# EAGLE schematic KombyPiMini (EAGLE 7.2.0)
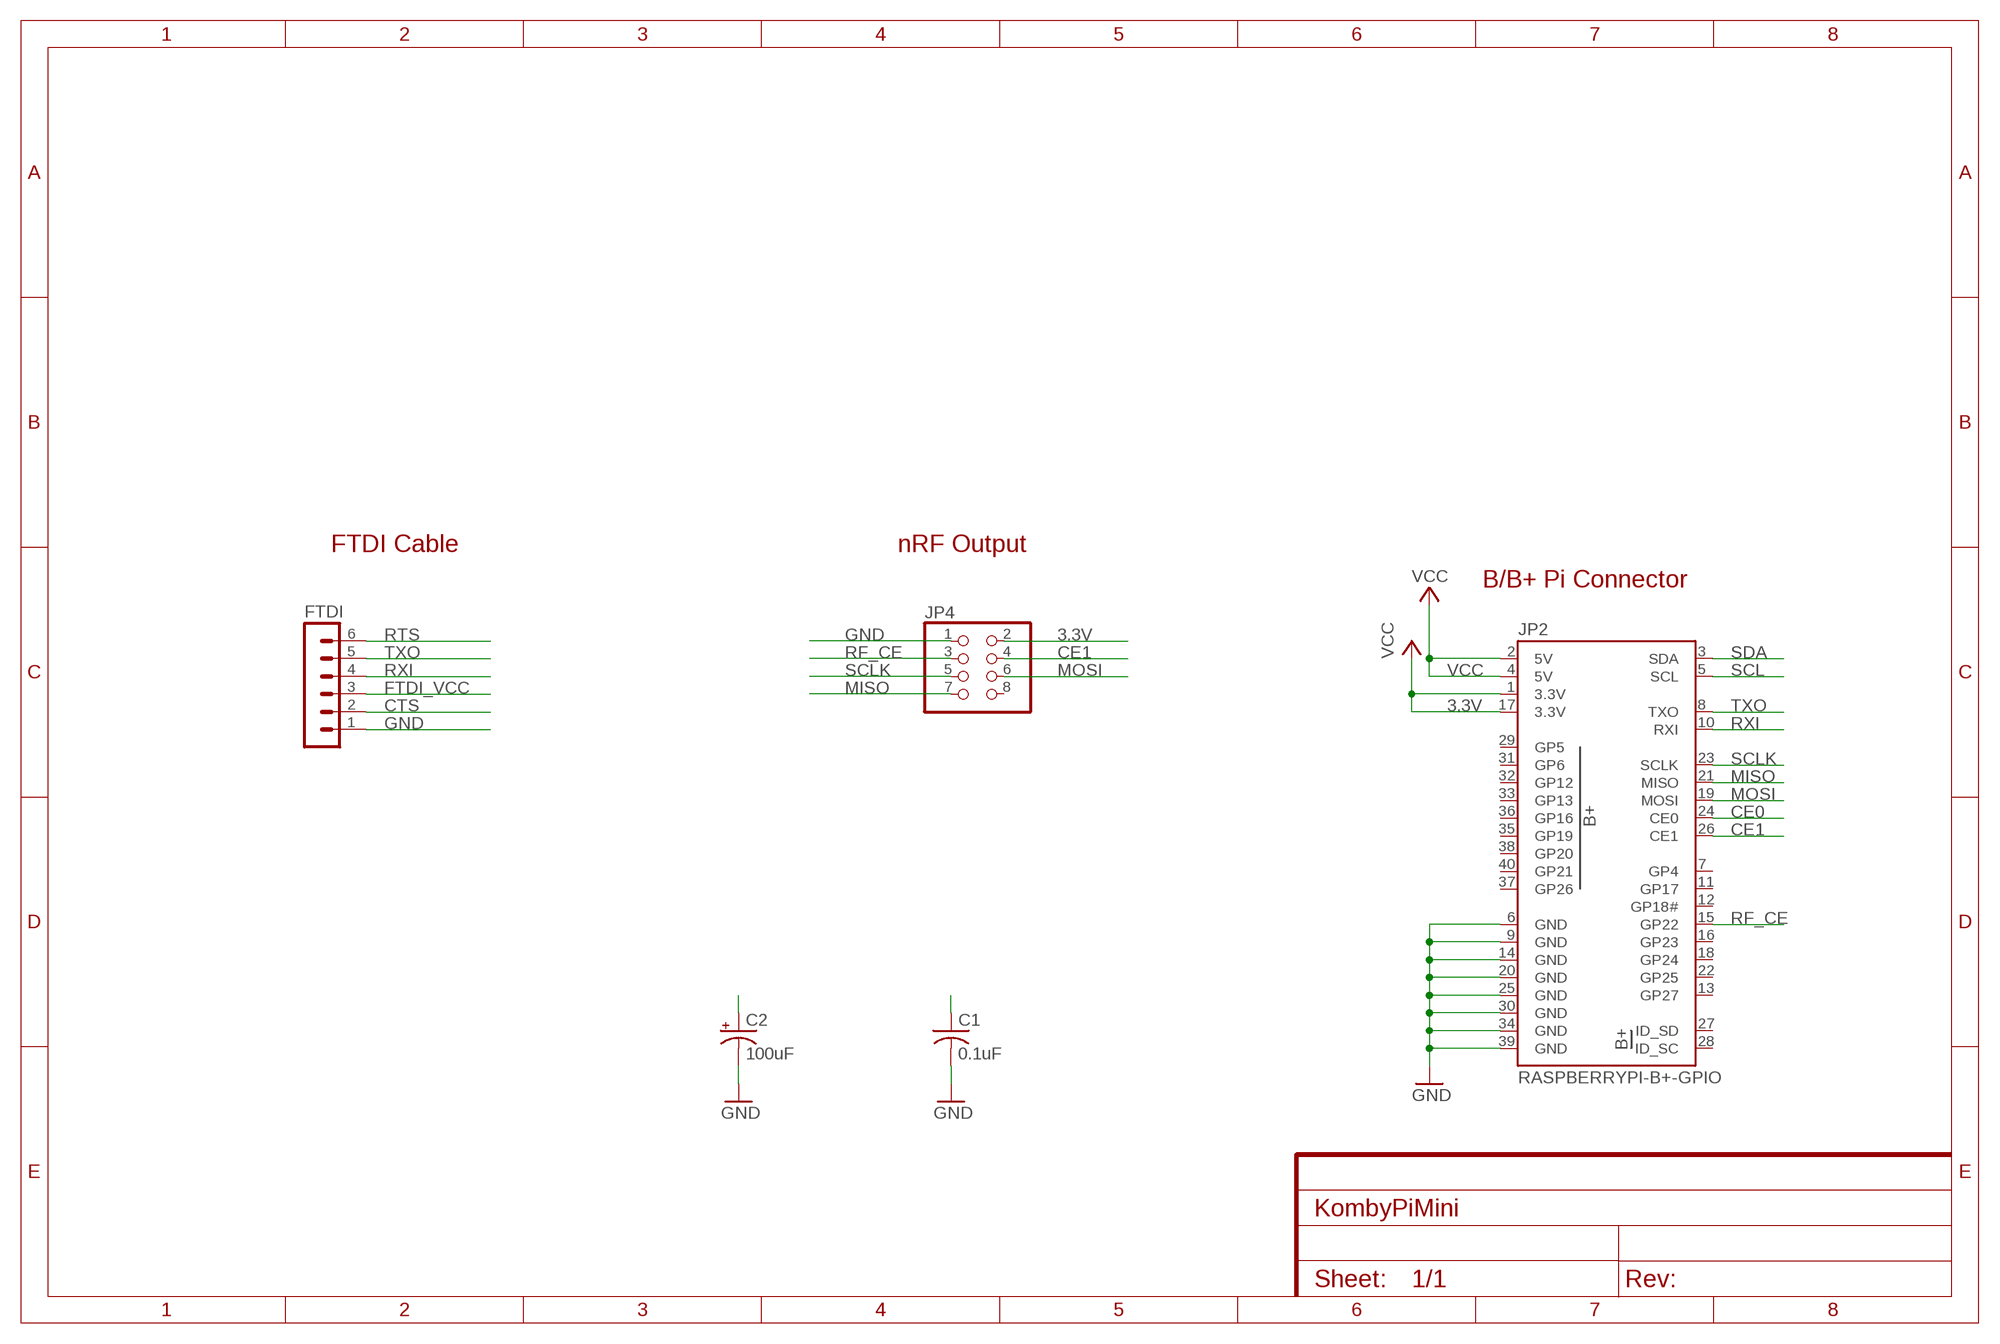
[diagram p0: schematic, sheet 1]

## Parts
C1  0.1uF  C-US025-025X050  [C025-025X050]
C2  100uF  CPOL-USE5-6  [E5-6]
FTDI  MA06-1  [MA06-1]
JP2  RASPBERRYPI-B+-GPIO  [2X20-SHROUDED]
JP4  PINHD-2X4  [2X04]

## Nets
3.3V [RFBoard]: C1.1 C2.+ JP2.1(3.3V) JP2.17(3.3V) JP4.2 ; supply symbol labelled VCC
CE0: JP2.24(CE0)
CE1 [RFBoard]: JP2.26(CE1) JP4.4
CTS: FTDI.2
FTDI_VCC: FTDI.3
GND: C1.2 C2.- FTDI.1 JP2.6(GND) JP2.9(GND) JP2.14(GND) JP2.20(GND) JP2.25(GND) JP2.30(GND) JP2.34(GND) JP2.39(GND) JP4.1
MISO [RFBoard]: JP2.21(MISO) JP4.7
MOSI [RFBoard]: JP2.19(MOSI) JP4.6
RF_CE [RFBoard]: JP2.15(GP22) JP4.3
RTS: FTDI.6
RXI: FTDI.4 JP2.10(RXI)
SCL: JP2.5(SCL)
SCLK: JP2.23(SCLK) JP4.5
SDA: JP2.3(SDA)
TXO: FTDI.5 JP2.8(TXO)
VCC: JP2.2(5V) JP2.4(5V)
Unconnected: JP2.7(GP4) JP2.11(GP17) JP2.12(GP18#) JP2.13(GP27) JP2.16(GP23) JP2.18(GP24) JP2.22(GP25) JP2.27(ID_SD) JP2.28(ID_SC) JP2.29(GP5) JP2.31(GP6) JP2.32(GP12) JP2.33(GP13) JP2.35(GP19) JP2.36(GP16) JP2.37(GP26) JP2.38(GP20) JP2.40(GP21) JP4.8

## Notes on the sheet
- FTDI Cable | nRF Output
- B/B+ Pi Connector

## Library data of the parts
C1 = adafruit:C-US: CAPACITOR, American symbol
C2 = rcl:CPOL-US: POLARIZED CAPACITOR, American symbol
FTDI = con-lstb:MA06-1: PIN HEADER; OC_FARNELL: unknown; OC_NEWARK: unknown
JP2 = SparkFun-Boards:RASPBERRYPI-B+-GPIO: Raspberry Pi B+ GPIO Header 2x20 pin connector
JP4 = adafruit:PINHD-2X4: PIN HEADER

## Net classes
1 RFBoard: width 0.406 mm